# EAGLE design PiBladeBackPlane-V1 (EAGLE 7.4.0)
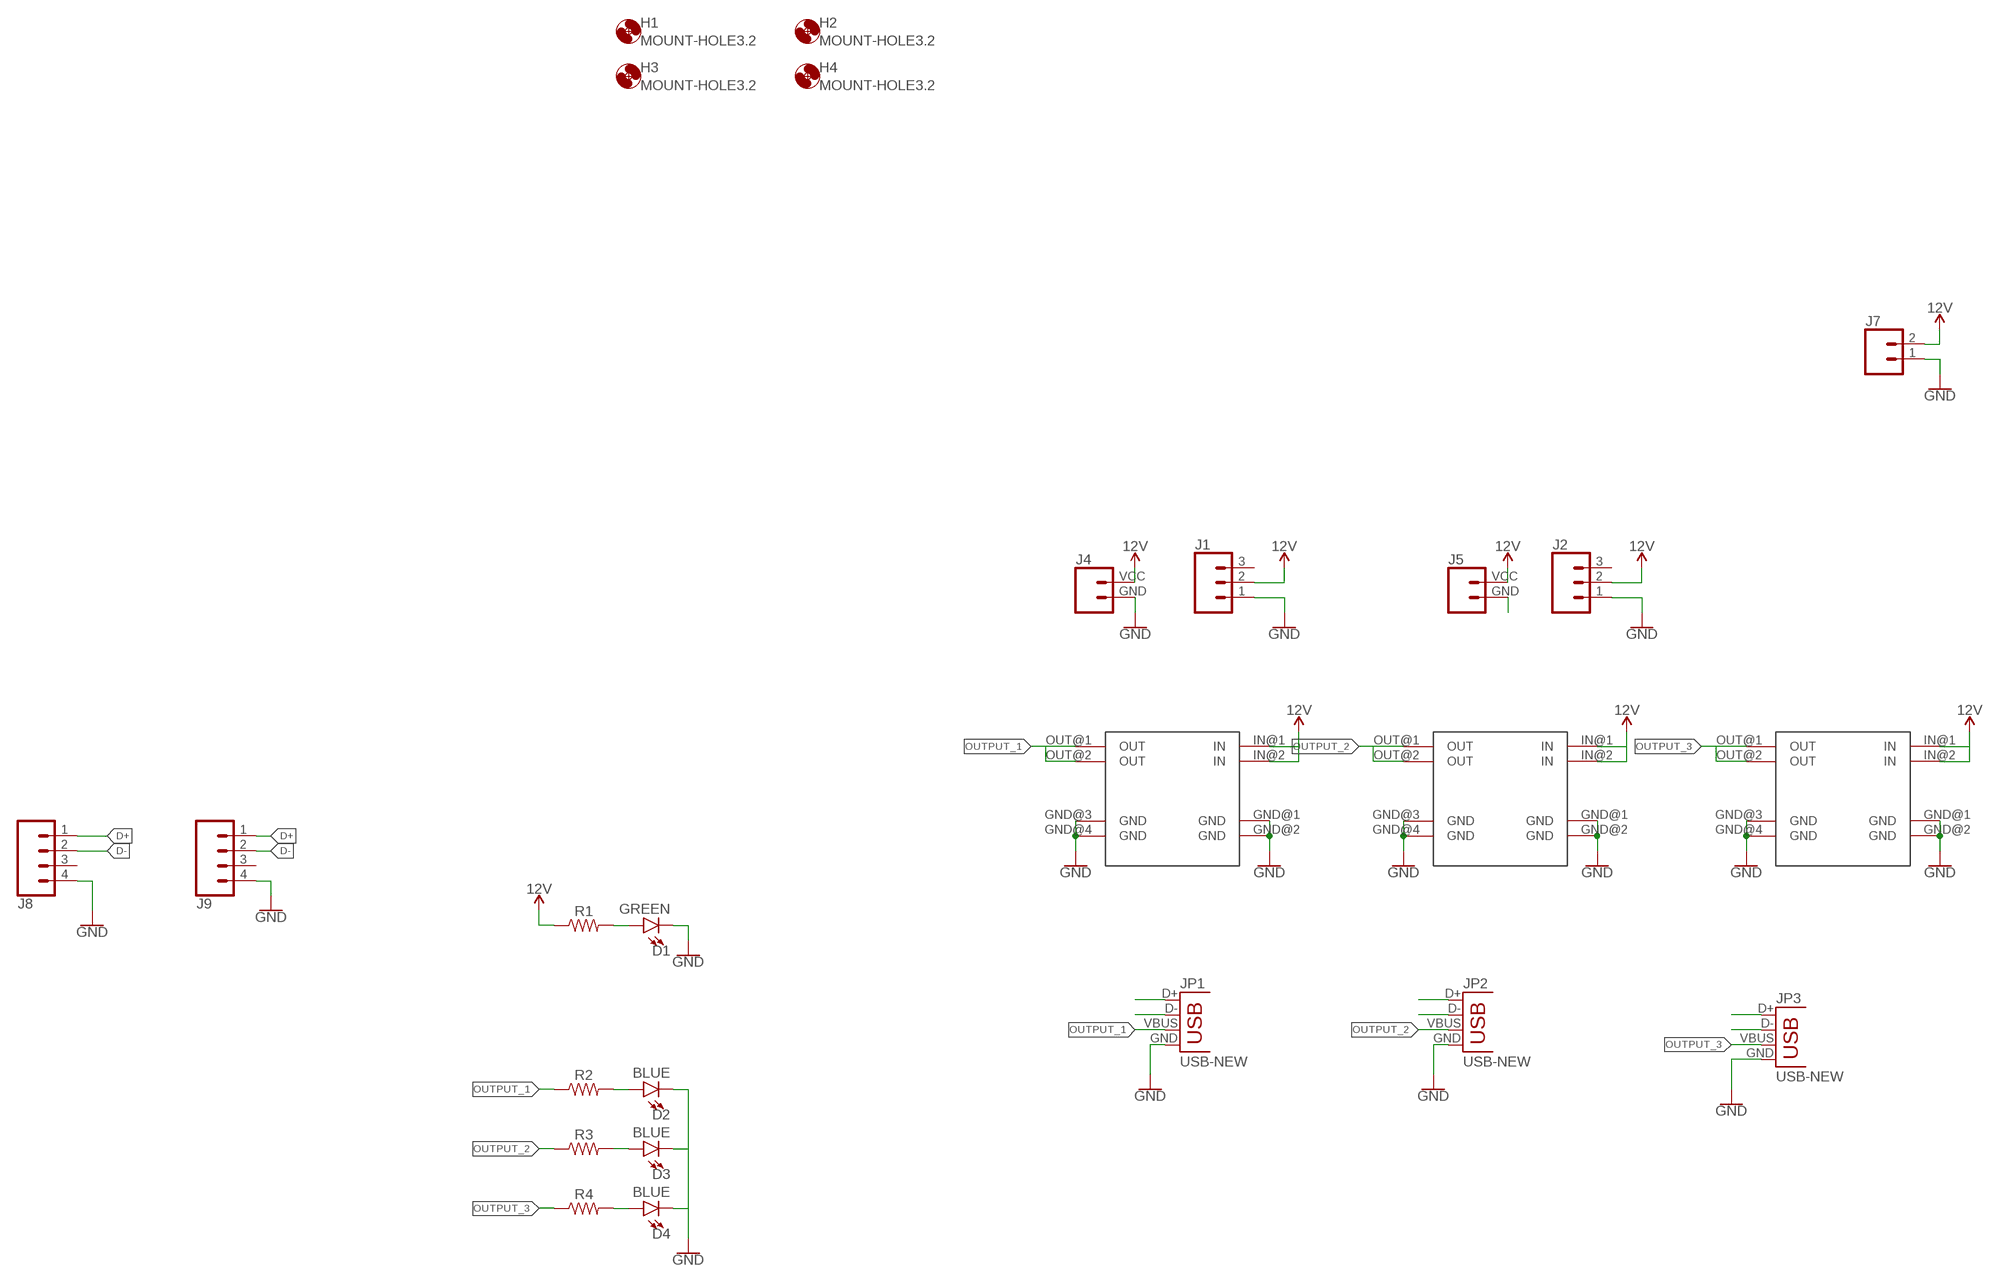
[diagram p0: schematic, sheet 1]

## Parts
D1  GREEN  LED-GREEN1206  [LED-1206]
D2  BLUE  LED-BLUE1206  [LED-1206]
D3  BLUE  LED-BLUE1206  [LED-1206]
D4  BLUE  LED-BLUE1206  [LED-1206]
H1  MOUNT-HOLE3.2  [3,2]
H2  MOUNT-HOLE3.2  [3,2]
H3  MOUNT-HOLE3.2  [3,2]
H4  MOUNT-HOLE3.2  [3,2]
J1  CONN_03POLAR  [MOLEX-1X3]
J2  CONN_03POLAR  [MOLEX-1X3]
J4  CONN_024UCON-15767  [JST-2-SMD-VERT]
J5  CONN_024UCON-15767  [JST-2-SMD-VERT]
J7  CONN_025MM  [SCREWTERMINAL-5MM-2]
J8  CONN_04JST-PTH-VERT  [JST-4-PTH-VERT]
J9  CONN_04JST-PTH-VERT  [JST-4-PTH-VERT]
JP1  USB-NEW  [USB-A-VERTICAL]
JP2  USB-NEW  [USB-A-VERTICAL]
JP3  USB-NEW  [USB-A-VERTICAL]
R1  RESISTOR1206  [1206]
R2  RESISTOR1206  [1206]
R3  RESISTOR1206  [1206]
R4  RESISTOR1206  [1206]
U$1  MINI-BUCK-MODULE-3A  [MINI-BUCK-MODULE-3A]
U$2  MINI-BUCK-MODULE-3A  [MINI-BUCK-MODULE-3A]
U$3  MINI-BUCK-MODULE-3A  [MINI-BUCK-MODULE-3A]

## Nets
12V: J1.2 J2.2 J4.VCC J5.VCC J7.2 R1.1 U$1.IN@1(IN) U$1.IN@2(IN) U$2.IN@1(IN) U$2.IN@2(IN) U$3.IN@1(IN) U$3.IN@2(IN)
D+: J8.1 J9.1 JP1.D+ JP2.D+ JP3.D+
D-: J8.2 J9.2 JP1.D- JP2.D- JP3.D-
GND: D1.C D2.C D3.C D4.C J1.1 J2.1 J4.GND J7.1 J8.4 JP1.GND JP2.GND JP3.GND U$1.GND@1(GND) U$1.GND@2(GND) U$1.GND@3(GND) U$1.GND@4(GND) U$2.GND@1(GND) U$2.GND@2(GND) U$2.GND@3(GND) U$2.GND@4(GND) U$3.GND@1(GND) U$3.GND@2(GND) U$3.GND@3(GND) U$3.GND@4(GND)
N$1: D1.A R1.2
N$3: D4.A R4.2
N$4: D2.A R2.2
N$7: D3.A R3.2
N$23: J5.GND
N$34: J9.4 ; supply symbol labelled GND
OUTPUT_1: JP1.VBUS R2.1 U$1.OUT@1(OUT) U$1.OUT@2(OUT)
OUTPUT_2: JP2.VBUS R3.1 U$2.OUT@1(OUT) U$2.OUT@2(OUT)
OUTPUT_3: JP3.VBUS R4.1 U$3.OUT@1(OUT) U$3.OUT@2(OUT)
Unconnected: J1.3 J2.3 J8.3 J9.3

## Library data of the parts
D1 = SparkFun-LED:LED-GREEN: Green SMD LED Used in manufacturing of various products at SparkFun Packages: 0603 - SMD 0603 package [Product Link] <http://www.futureelectronics.com/en/technologies/semiconductors/optoelectronics/leds/Pages/9894312-LTST-C190GKT.aspx?CrossPart=HSMG-C190&IM=0> LilyPad 1206 - SMD1206 LilyPad package [Product Link] <http://www.futureelectronics.com/en/Technologies/Product.aspx?ProductID=IN150NGHARVATEKCORPORATION2049943&IM=0> 1206 - SMD1206 package [Product Link] <http://www.futureelectronics.com/en/technologies/semiconductors/optoelectronics/leds/Pages/8315665-LTST-C150KGKT.aspx?IM=0> 1206 Bottom Mount -SMD 1206 Bottom Mount [Product Link] <http://www.digikey.com/product-detail/en/lite-on-inc/LTST-C230KGKT/160-1456-1-ND/386854> SparkFun Products: Pro Mini 328 -5V <https://www.sparkfun.com/products/821> RedBoard <https://www.sparkfun.com/products/12757> MP3 Trigger <https://www.sparkfun.com/products/13720> Makey Makey <https://www.sparkfun.com/products/11076>; PROD_ID: DIO-00862
D2-D4 = SparkFun-LED:LED-BLUE: Blue SMD LED Used in manufacturing of various products at SparkFun Packages: 0603 - SMD 0603 package [Product Link] <http://www.digikey.com/product-detail/en/SMLE12BC7TT86/511-1589-2-ND/1641808> 1206 - SMD1206 package [Product Link] <http://www.digikey.com/product-detail/en/lite-on-inc/LTST-C150TBKT/160-1643-1-ND/573584> SparkFun Products: ESP8266 Thing-Dev Board <https://www.sparkfun.com/products/13711> RedBoard <https://www.sparkfun.com/products/12757>; PROD_ID: DIO-09911
H1-H4 = holes:MOUNT-HOLE: MOUNTING HOLE with drill center marker
J1 J2 = SparkFun-Connectors:CONN_03: Multi connection point. Often used as Generic Header-pin footprint for 0.1 inch spaced/style header connections On any of the 0.1 inch spaced packages, you can populate with these: Break Away Headers - Straight <https://www.sparkfun.com/products/116> (PRT-00116) Break Away Male Headers - Right Angle <https://www.sparkfun.com/products/553> (PRT-00553) Female Headers <https://www.sparkfun.com/products/115> (PRT-00115) Break Away Headers - Machine Pin <https://www.sparkfun.com/products/117> (PRT-00117) Break Away Female Headers - Swiss Machine Pin <https://www.sparkfun.com/products/743> (PRT-00743) Stackable Header - 3 Pin (Female, 0.1") <https://www.sparkfun.com/products/13875> (PRT-13875) For SCREWTERMINALS and SPRING TERMINALS visit here: Screw Terimnals on SparkFun.com <https://www.sparkfun.com/search/results?term=Screw+Terminals> (5mm/3.5mm/2.54mm spacing) This device is also useful as a general connection point to wire up your design to another part of your project. Our various solder wires solder well into these plated through hole pads. Hook-Up Wire - Assortment (Stranded, 22 AWG) <https://www.sparkfun.com/products/11375> (PRT-11375) Hook-Up Wire - Assortment (Solid Core, 22 AWG) <https://www.sparkfun.com/products/11367> (PRT-11367) View the entire wire category on our website here <https://www.sparkfun.com/categories/141> Special notes: Molex polarized connector foot print use with SKU : PRT-08232 with associated crimp pins and housings.; PROD_ID: CONN-08625; SF_ID: PRT-08096
J4 J5 = SparkFun-Connectors:CONN_02: Multi connection point. Often used as Generic Header-pin footprint for 0.1 inch spaced/style header connections On any of the 0.1 inch spaced packages, you can populate with these: Break Away Headers - Straight <https://www.sparkfun.com/products/116> (PRT-00116) Break Away Male Headers - Right Angle <https://www.sparkfun.com/products/553> (PRT-00553) Female Headers <https://www.sparkfun.com/products/115> (PRT-00115) Break Away Headers - Machine Pin <https://www.sparkfun.com/products/117> (PRT-00117) Break Away Female Headers - Swiss Machine Pin <https://www.sparkfun.com/products/743> (PRT-00743) For SCREWTERMINALS and SPRING TERMINALS visit here: Screw Terimnals on SparkFun.com <https://www.sparkfun.com/search/results?term=Screw+Terminals> (5mm/3.5mm/2.54mm spacing) This device is also useful as a general connection point to wire up your design to another part of your project. Our various solder wires solder well into these plated through hole pads. Hook-Up Wire - Assortment (Stranded, 22 AWG) <https://www.sparkfun.com/products/11375> (PRT-11375) Hook-Up Wire - Assortment (Solid Core, 22 AWG) <https://www.sparkfun.com/products/11367> (PRT-11367) View the entire wire category on our website here <https://www.sparkfun.com/categories/141> Special notes: Molex polarized connector foot print use with: PRT-08233 with associated crimp pins and housings. 2.54_SCREWTERM for use with PRT-10571. 3.5mm Screw Terminal footprints for PRT-08084 5mm Screw Terminal footprints for use with PRT-08432
J7 = SparkFun-Connectors:CONN_02: Multi connection point. Often used as Generic Header-pin footprint for 0.1 inch spaced/style header connections On any of the 0.1 inch spaced packages, you can populate with these: Break Away Headers - Straight <https://www.sparkfun.com/products/116> (PRT-00116) Break Away Male Headers - Right Angle <https://www.sparkfun.com/products/553> (PRT-00553) Female Headers <https://www.sparkfun.com/products/115> (PRT-00115) Break Away Headers - Machine Pin <https://www.sparkfun.com/products/117> (PRT-00117) Break Away Female Headers - Swiss Machine Pin <https://www.sparkfun.com/products/743> (PRT-00743) For SCREWTERMINALS and SPRING TERMINALS visit here: Screw Terimnals on SparkFun.com <https://www.sparkfun.com/search/results?term=Screw+Terminals> (5mm/3.5mm/2.54mm spacing) This device is also useful as a general connection point to wire up your design to another part of your project. Our various solder wires solder well into these plated through hole pads. Hook-Up Wire - Assortment (Stranded, 22 AWG) <https://www.sparkfun.com/products/11375> (PRT-11375) Hook-Up Wire - Assortment (Solid Core, 22 AWG) <https://www.sparkfun.com/products/11367> (PRT-11367) View the entire wire category on our website here <https://www.sparkfun.com/categories/141> Special notes: Molex polarized connector foot print use with: PRT-08233 with associated crimp pins and housings. 2.54_SCREWTERM for use with PRT-10571. 3.5mm Screw Terminal footprints for PRT-08084 5mm Screw Terminal footprints for use with PRT-08432; SF_SKU: PRT-08432
J8 J9 = SparkFun-Connectors:CONN_04: Multi connection point. Often used as Generic Header-pin footprint for 0.1 inch spaced/style header connections On any of the 0.1 inch spaced packages, you can populate with these: Break Away Headers - Straight <https://www.sparkfun.com/products/116> (PRT-00116) Break Away Male Headers - Right Angle <https://www.sparkfun.com/products/553> (PRT-00553) Female Headers <https://www.sparkfun.com/products/115> (PRT-00115) Break Away Headers - Machine Pin <https://www.sparkfun.com/products/117> (PRT-00117) Break Away Female Headers - Swiss Machine Pin <https://www.sparkfun.com/products/743> (PRT-00743) For SCREWTERMINALS and SPRING TERMINALS visit here: Screw Terimnals on SparkFun.com <https://www.sparkfun.com/search/results?term=Screw+Terminals> (5mm/3.5mm/2.54mm spacing) This device is also useful as a general connection point to wire up your design to another part of your project. Our various solder wires solder well into these plated through hole pads. Hook-Up Wire - Assortment (Stranded, 22 AWG) <https://www.sparkfun.com/products/11375> (PRT-11375) Hook-Up Wire - Assortment (Solid Core, 22 AWG) <https://www.sparkfun.com/products/11367> (PRT-11367) View the entire wire category on our website here <https://www.sparkfun.com/categories/141> Special notes: Molex polarized connector foot print use with SKU : PRT-08231 with associated crimp pins and housings. 1MM SMD Version SKU: PRT-10208; PROD_ID: CONN-13251
JP1-JP3 = Tinamous:USB-NEW: USB Connectors USB-B-PTH is fully proven SKU : PRT-00139/CONN-08278 USB-miniB is fully proven SKU : PRT-00587 USB-A-PCB is untested. USB-A-H is throughly reviewed, but untested. Spark Fun Electronics SKU : PRT-00437 USB-B-SMT is throughly reviewed, but untested. Needs silkscreen touching up. USB-A-S has not been used/tested USB-MB-H has not been used/tested USB-MICROB has been used. CONN-09505
R1-R4 = SparkFun-Resistors:RESISTOR: Generic Resistor Package
U$1-U$3 = Tinamous:MINI-BUCK-MODULE-3A

## Board
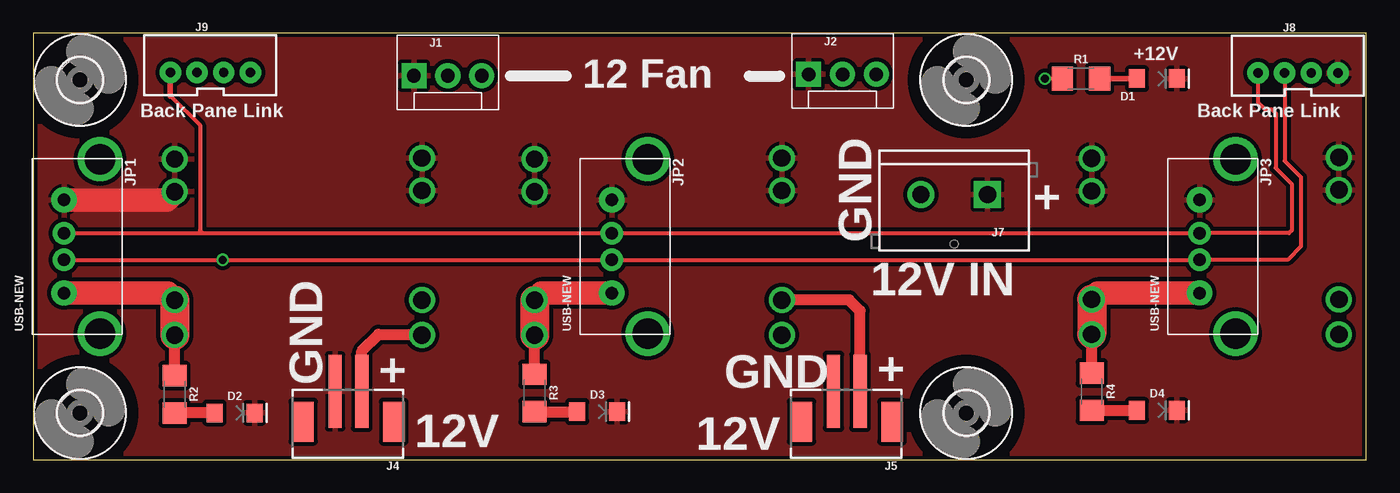
[diagram p1: board, top side]
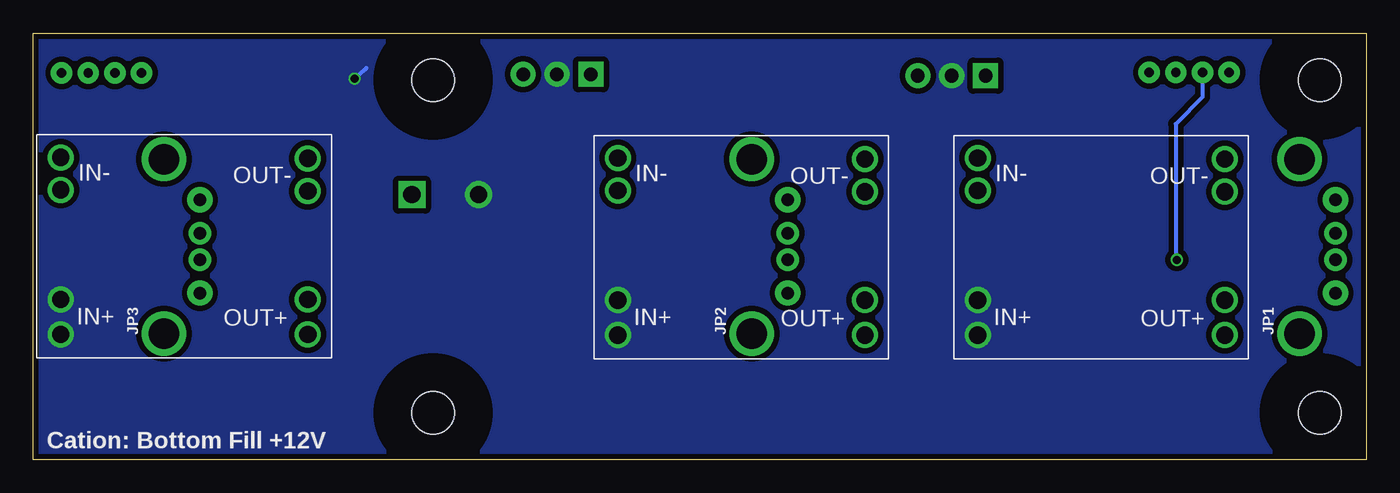
[diagram p2: board, bottom side, seen from below]

Size 100 x 32 mm. Coordinates in mm from the lower left corner, seen from the top.
Outline: 0,0 100,0 100,32 0,32 0,0
Copper layers (1*16): Top 0.035mm / dielectric 1.5mm / Bottom 0.035mm
Design rules "dirt_cheap_dirty_boards.v1": minimum track width 5mil, minimum drill 12mil, track to track 5mil, track to pad 5mil, pad to pad 5mil, via to via 5mil, smd to smd 0mil, copper to edge 10mil, drill to drill 10mil, minimum pad ring 10mil, minimum via ring 6mil, stop-mask expansion 2mil, vias tented up to drill 25mil, thermal gap 10mil

### Footprints (pad centres in the part's own frame; a part is rotated, then mirrored left to right if it is on the bottom)
LED-1206 = smd 1.2 x 1.4: A -1.5,0; C 1.5,0
3,2 = hole 3.2: 0,0
MOLEX-1X3 = drill 1.016 pad 1.88 square: 1 0,0 | drill 1.016 pad 1.88: 2 2.54,0; 3 5.08,0
JST-2-SMD-VERT = smd 1 x 5.5: GND 1,-2; VCC -1,-2 | smd 1.6 x 3: P$1 -3.4,0.27; P$2 3.4,0.27
SCREWTERMINAL-5MM-2 = drill 1.3 pad 2.032 square: 1 0,0 | drill 1.3 pad 2.032: 2 5,0
JST-4-PTH-VERT = drill 0.7 pad 1.6: 1 -3,-0.55; 2 -1,-0.55; 3 1,-0.55; 4 3,-0.55
USB-A-VERTICAL = drill 0.95 pad 1.676: D+ 2.7,1; D- 2.7,-1 | drill 0.95 pad 1.88: GND 2.7,3.5; VBUS 2.7,-3.5 | drill 2.3: SHLD1 0,-6.55; SHLD2 0,6.55
1206 = smd 1.6 x 1.8: 1 -1.4,0; 2 1.4,0
MINI-BUCK-MODULE-3A = drill 1.3: GND@1 20.32,4.13; GND@2 20.32,1.7; GND@3 1.778,4.228; GND@4 1.778,1.778; IN@1 20.32,14.986; IN@2 20.32,12.356; OUT@1 1.778,14.986; OUT@2 1.778,12.356

### Placement (x,y rotation side)
D1  84.3,28.6 0 top
D2  15.1,3.5 0 top
D3  42.3,3.6 0 top
D4  84.3,3.7 0 top
H1  3.5,28.5 0 top
H2  3.5,3.5 0 top
H3  70,28.5 0 top
H4  70,3.5 0 top
J1  28.56,28.82 0 top
J2  58.17,28.92 0 top
J4  23.64,3.12 180 top
J5  61.03,3.12 180 top
J7  71.59,19.89 180 top
J8  94.88,29.57 0 top
J9  13.28,29.61 0 top
JP1  5,16 0 bottom
JP2  46.1,16 0 bottom
JP3  90.2,16 0 bottom
R1  78.6,28.6 0 top
R2  10.6,4.9 270 top
R3  37.6,5 270 top
R4  79.4,5.1 270 top
U$1  8.83,24.33 180 bottom
U$2  35.83,24.33 180 bottom
U$3  77.63,24.38 180 bottom

### Tracks (layer width: path | path; a pad name or v marks a point on that pad's centre or on a via)
12V  (via drill 0.6)
  Top 0.305: R1.1 v75.9,28.6
  Top 0.813: J4.VCC 24.64,8.14 25.9,9.4 29.09,9.4 U$1.IN@1 | J5.VCC 62.03,11.17 61.2,12 56.18,12 U$2.IN@2
  Bottom 0.305: v75.9,28.6 75.1,29.3 75,29.4
  pour Bottom (isolate 0.406, rank 6, no thermals): -2.2,33.5 102.3,33.5 102.3,-1.6 -2.2,-1.6
D+
  Top 0.305: JP1.D+ 12.7,17 | 12.7,17 JP2.D+ 87.1,17 | 87.1,17 JP3.D+ 94.2,17 94.4,17.2 94.4,20.7 93.2,21.9 93.2,26 92.9,26.3 92.4,26.3 91.88,26.82 J8.1 | 87.2,17.1 87.1,17 | 10.28,27.28 10.32,27.28 12.5,25.1 12.5,17.2 12.7,17
  Top 0.406: J9.1 10.28,27.28
D-  (via drill 0.6)
  Top 0.305: JP1.D- v14.2,15 JP2.D- JP3.D- 94.1,15 95.1,16 95.1,21.2 93.88,22.42 J8.2
  Bottom 0.305: J9.2 12.28,27.22 14.3,25.2 14.3,15.1 v14.2,15
GND
  Top 1.778: JP1.GND 10.01,19.5 U$1.GND@3
  pour Top (isolate 0.305): -0.9,32.6 100.7,32.6 100.7,-0.6 -0.9,-0.6 -0.9,32.4
N$1
  Top 0.406: R1.2 D1.A
N$3
  Top 0.813: R4.2 D4.A
N$4
  Top 0.813: D2.A R2.2
N$7
  Top 0.813: R3.2 D3.A
OUTPUT_1
  Top 0.813: R2.1 U$1.OUT@1
  Top 1.778: JP1.VBUS 10.08,12.5 U$1.OUT@2
  Top 2.184: U$1.OUT@2 U$1.OUT@1
OUTPUT_2
  Top 0.813: R3.1 U$2.OUT@1
  Top 1.778: JP2.VBUS 38.13,12.5 U$2.OUT@2
  Top 2.184: U$2.OUT@2 U$2.OUT@1
OUTPUT_3
  Top 0.813: R4.1 U$3.OUT@1
  Top 1.778: JP3.VBUS 79.88,12.5 U$3.OUT@2
  Top 2.184: U$3.OUT@2 U$3.OUT@1

### Text on the board
tNames: +12V | 12 Fan | Back Pane Link | Back Pane Link | + | GND | 12V IN | GND | GND | + | + | 12V | 12V
bNames: Cation: Bottom Fill +12V